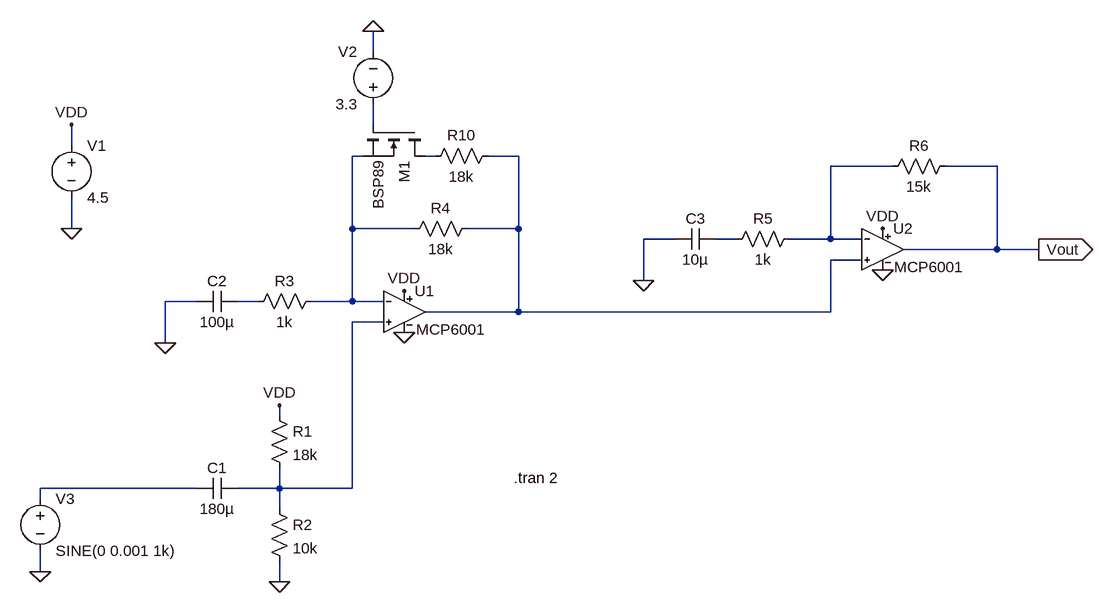
[diagram p0: schematic pre_amp_GANHO_VARIAVEL.asc]
pre_amp_GANHO_VARIAVEL.asc, the LTspice schematic file:
Version 4
SHEET 1 1456 680
WIRE 288 -320 288 -352
WIRE 288 -208 288 -240
WIRE -176 -176 -176 -208
WIRE 272 -160 256 -160
WIRE 384 -160 368 -160
WIRE 512 -160 464 -160
WIRE 1088 -144 992 -144
WIRE 1248 -144 1168 -144
WIRE -176 -48 -176 -96
WIRE 256 -48 256 -160
WIRE 352 -48 256 -48
WIRE 512 -48 512 -160
WIRE 512 -48 432 -48
WIRE 752 -32 704 -32
WIRE 848 -32 816 -32
WIRE 992 -32 992 -144
WIRE 992 -32 928 -32
WIRE 1040 -32 992 -32
WIRE 1248 -16 1248 -144
WIRE 1248 -16 1104 -16
WIRE 1312 -16 1248 -16
WIRE 1040 0 992 0
WIRE 704 32 704 -32
WIRE 16 64 -32 64
WIRE 112 64 80 64
WIRE 256 64 256 -48
WIRE 256 64 192 64
WIRE 304 64 256 64
WIRE 512 80 512 -48
WIRE 512 80 368 80
WIRE 992 80 992 0
WIRE 992 80 512 80
WIRE 304 96 256 96
WIRE -32 128 -32 64
WIRE 144 240 144 224
WIRE 16 352 -224 352
WIRE 144 352 144 320
WIRE 144 352 80 352
WIRE 256 352 256 96
WIRE 256 352 144 352
WIRE -224 368 -224 352
WIRE 144 384 144 352
WIRE -224 480 -224 448
WIRE 144 496 144 464
FLAG -32 128 0
FLAG 144 496 0
FLAG 144 224 VDD
FLAG 336 48 VDD
FLAG 336 112 0
FLAG -176 -208 VDD
FLAG -176 -48 0
FLAG 704 32 0
FLAG 1072 -48 VDD
FLAG 1072 16 0
FLAG 1312 -16 Vout
IOPIN 1312 -16 Out
FLAG -224 480 0
FLAG 288 -352 0
SYMBOL res 128 224 R0
SYMATTR InstName R1
SYMATTR Value 18k
SYMBOL res 128 368 R0
SYMATTR InstName R2
SYMATTR Value 10k
SYMBOL cap 80 336 R90
WINDOW 0 0 32 VBottom 2
WINDOW 3 32 32 VTop 2
SYMATTR InstName C1
SYMATTR Value 180µ
SYMBOL res 208 48 R90
WINDOW 0 0 56 VBottom 2
WINDOW 3 32 56 VTop 2
SYMATTR InstName R3
SYMATTR Value 1k
SYMBOL res 448 -64 R90
WINDOW 0 0 56 VBottom 2
WINDOW 3 32 56 VTop 2
SYMATTR InstName R4
SYMATTR Value 18k
SYMBOL cap 80 48 R90
WINDOW 0 0 32 VBottom 2
WINDOW 3 32 32 VTop 2
SYMATTR InstName C2
SYMATTR Value 100µ
SYMBOL voltage -176 -192 R0
WINDOW 123 0 0 Left 0
WINDOW 39 0 0 Left 0
SYMATTR InstName V1
SYMATTR Value 4.5
SYMBOL res 944 -48 R90
WINDOW 0 0 56 VBottom 2
WINDOW 3 32 56 VTop 2
SYMATTR InstName R5
SYMATTR Value 1k
SYMBOL res 1184 -160 R90
WINDOW 0 0 56 VBottom 2
WINDOW 3 32 56 VTop 2
SYMATTR InstName R6
SYMATTR Value 15k
SYMBOL cap 816 -48 R90
WINDOW 0 0 32 VBottom 2
WINDOW 3 32 32 VTop 2
SYMATTR InstName C3
SYMATTR Value 10µ
SYMBOL MCP6001_AB 336 16 R0
SYMATTR InstName U1
SYMBOL MCP6001_AB 1072 -80 R0
SYMATTR InstName U2
SYMBOL voltage -224 352 R0
WINDOW 123 0 0 Left 0
WINDOW 39 0 0 Left 0
SYMATTR InstName V3
SYMATTR Value SINE(0 0.001 1k)
SYMBOL nmos 368 -208 R90
SYMATTR InstName M1
SYMATTR Value BSP89
SYMBOL voltage 288 -224 R180
WINDOW 0 24 96 Left 2
WINDOW 3 24 16 Left 2
WINDOW 123 0 0 Left 0
WINDOW 39 0 0 Left 0
SYMATTR InstName V2
SYMATTR Value 3.3
SYMBOL res 480 -176 R90
WINDOW 0 0 56 VBottom 2
WINDOW 3 32 56 VTop 2
SYMATTR InstName R10
SYMATTR Value 18k
TEXT 504 336 Left 2 !.tran 2

The netlist it stands for:
* pre_amp_GANHO_VARIAVEL.asc
R1 VDD N008 18k
R2 N008 0 10k
C1 N008 N009 180µ
R3 N002 N007 1k
R4 N004 N002 18k
C2 N007 0 100µ
V1 VDD 0 4.5
R5 N005 N006 1k
R6 Vout N005 15k
C3 N006 0 10µ
XU1 N008 N002 VDD 0 N004 MCP6001  ; pins In+ In- V+ V- OUT
XU2 N004 N005 VDD 0 Vout MCP6001  ; pins In+ In- V+ V- OUT
V3 N009 0 SINE(0 0.001 1k)
M1 N003 N001 N002 N002 BSP89
V2 N001 0 3.3
R10 N004 N003 18k
.model NMOS NMOS
.model PMOS PMOS
.lib standard.mos
.tran 2
.lib MCP6001.lib
.backanno
.end